# EAGLE design angle_brick (EAGLE 7.2.0)
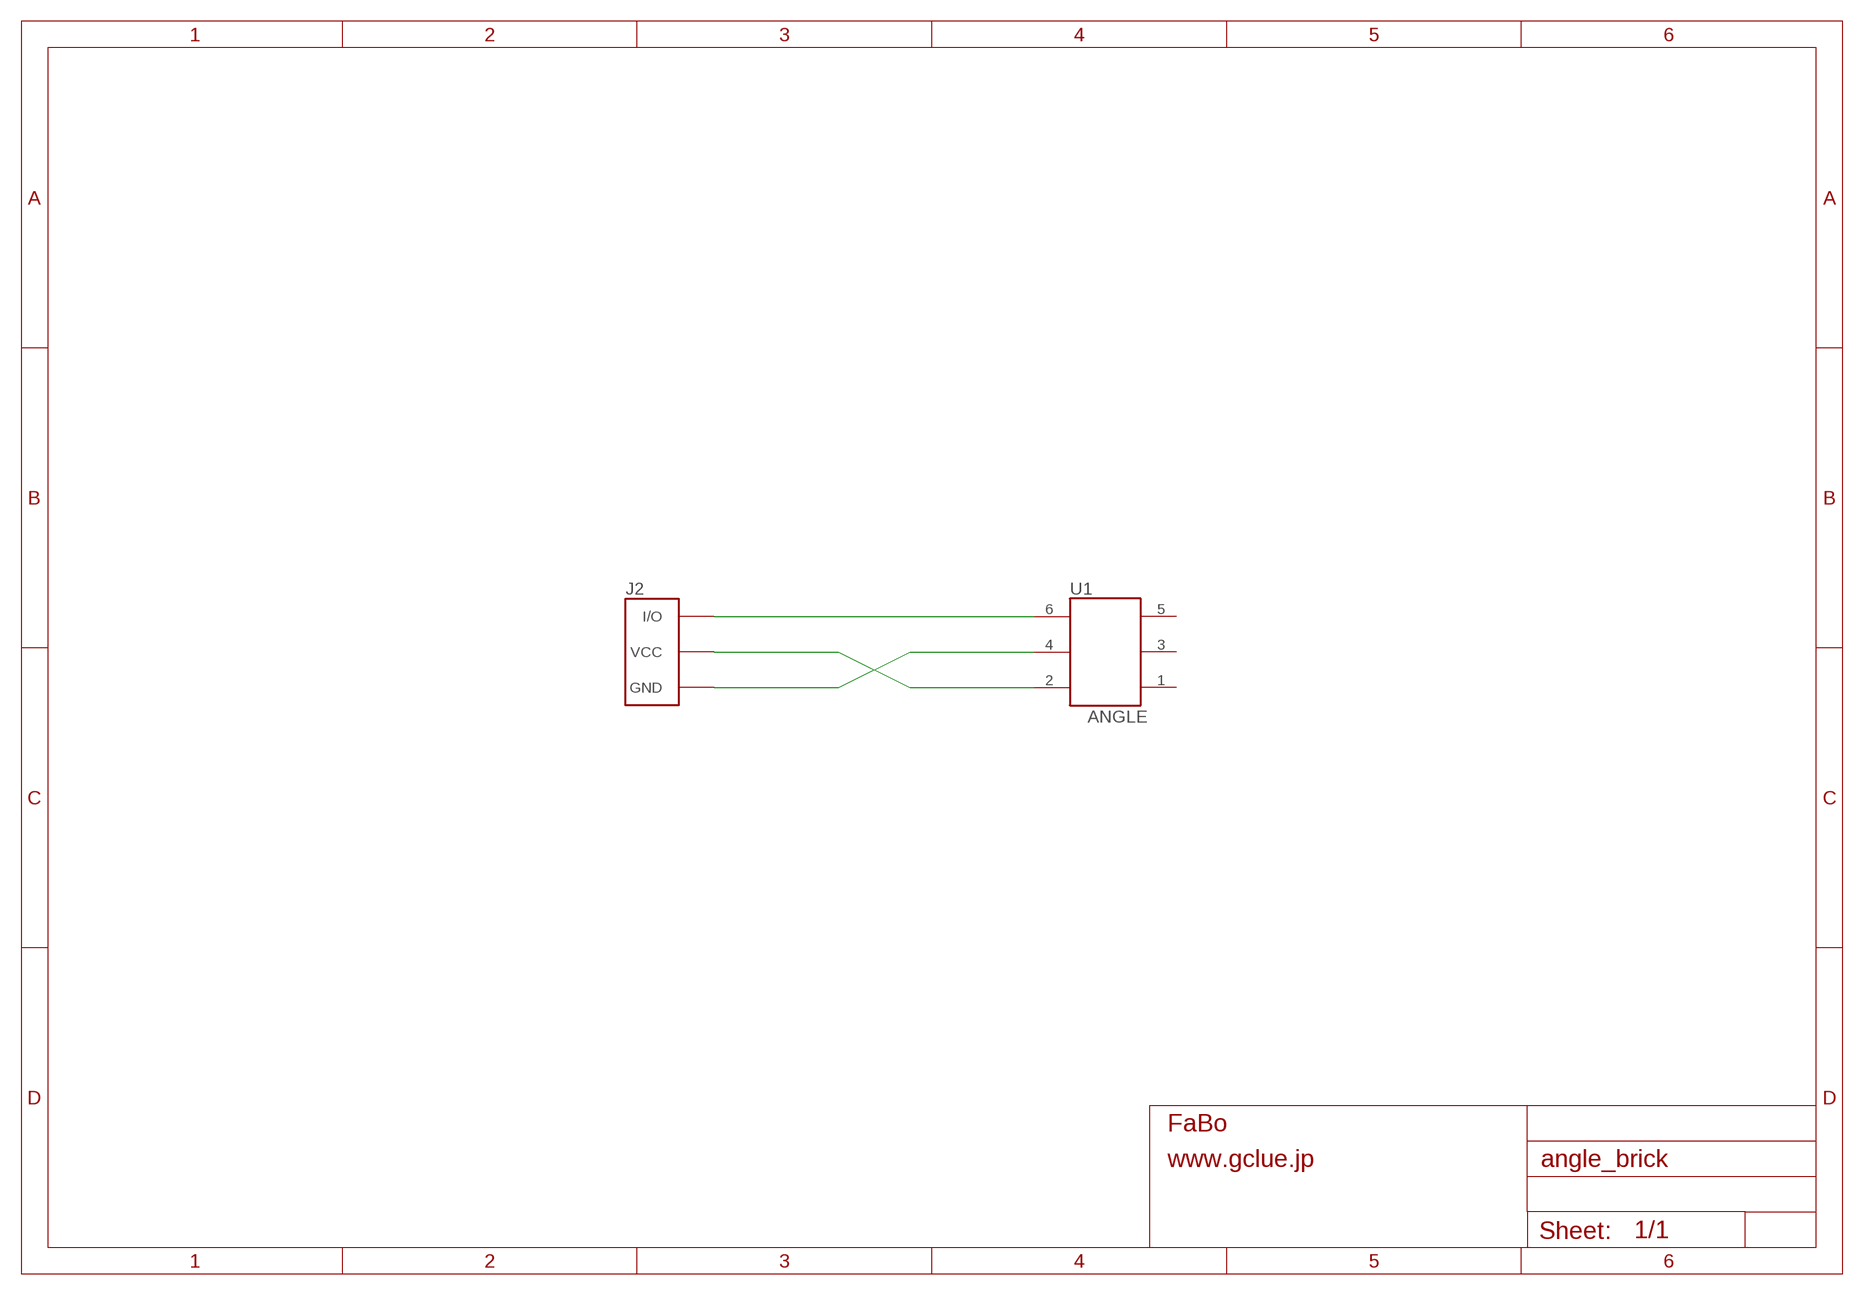
[diagram p0: schematic, sheet 1]

## Parts
J2  BRICK_3PIN  [BRICK_3PIN]
U1  ANGLE  ROTARYENCORDER_BRICK  [ROTARYENCORDER_BRICK]

## Nets
GND: J2.GND U1.4
N$1: J2.IN/OUT(I/O) U1.6
VCC: J2.VCC U1.2
Unconnected: U1.1 U1.3 U1.5

## Library data of the parts
J2 = gclue:BRICK_3PIN: FaBo Brick 3pin
U1 = gclue:ROTARYENCORDER_BRICK: Rotary Encorder for Brick

## Board
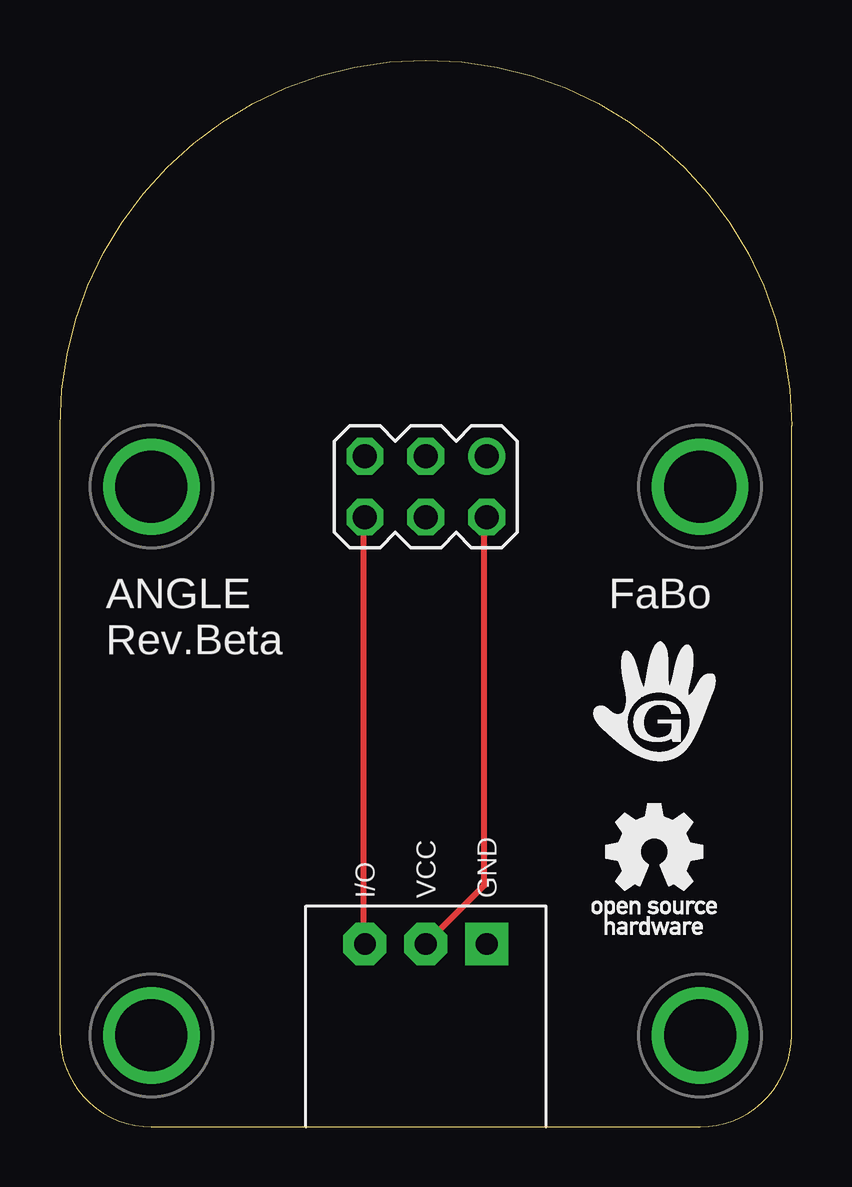
[diagram p1: board, top side]
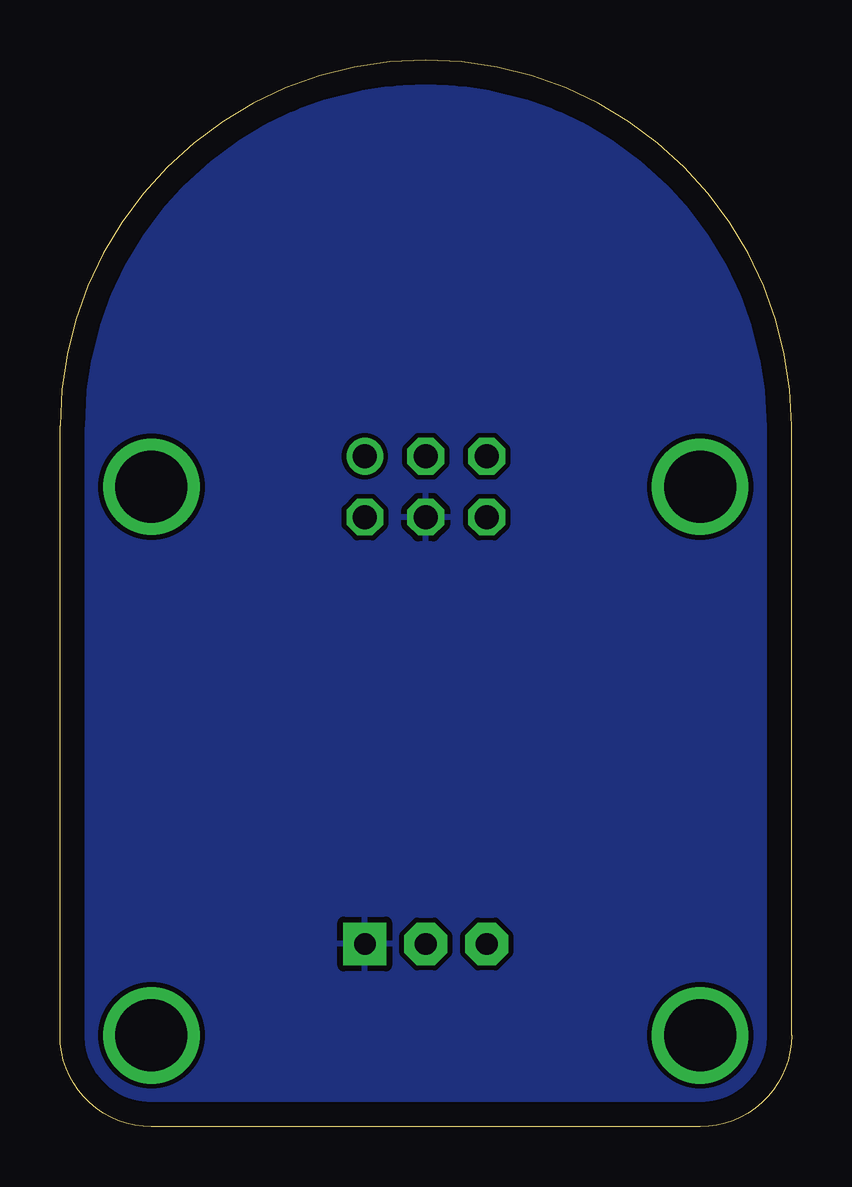
[diagram p2: board, bottom side, seen from below]

Size 30.48 x 44.45 mm. Coordinates in mm from the lower left corner, seen from the top.
Copper layers (1*16): Top 0.035mm / dielectric 1.5mm / Bottom 0.035mm
Design rules "default": minimum track width 10mil, minimum drill 24mil, track to track 8mil, track to pad 8mil, pad to pad 8mil, via to via 8mil, smd to smd 8mil, copper to edge 40mil, drill to drill 8mil, minimum pad ring 10mil, minimum via ring 8mil, stop-mask expansion 4mil, vias tented up to drill 0mil, thermal gap 10mil

### Footprints (pad centres in the part's own frame; a part is rotated, then mirrored left to right if it is on the bottom)
BRICK_3PIN = drill 0.9 pad 1.778 square: GND 2.54,-11.43 | drill 0.9 pad 1.778 octagon: IN/OUT -2.54,-11.43; VCC 0,-11.43 | drill 3 pad 3.81: P$1 -11.43,7.62; P$2 11.43,7.62; P$3 11.43,-15.24; P$4 -11.43,-15.24
ROTARYENCORDER_BRICK = drill 1.016: 1 -2.54,-1.27 | drill 1.016 octagon: 2 -2.54,1.27; 3 0,-1.27; 4 0,1.27; 5 2.54,-1.27; 6 2.54,1.27

### Placement (x,y rotation side)
J2  15.24,19.05 0 top
U1  15.24,26.67 180 top
U$2  [LOGO_OSHW_T_M]  24.77,11.43 0 top
U$4  [LOGO_GCLUE_M]  24.77,17.78 0 top

### Tracks (layer width: path | path; a pad name or v marks a point on that pad's centre or on a via)
GND
  pour Bottom: -0.64,0 30.48,0.64 31.12,45.09 0,44.45
N$1
  Top 0.254: U1.6 12.65,25.38 12.65,7.77 J2.IN/OUT
VCC
  Top 0.254: J2.VCC 17.68,10.06 17.68,25.38 U1.2

### Text on the board
tPlace: FaBo | ANGLE / Rev.Beta